# Altium schematic sheet lms_interface.SchDoc
size 381 x 241 mm; SheetNumber: 14; SheetTotal: 17
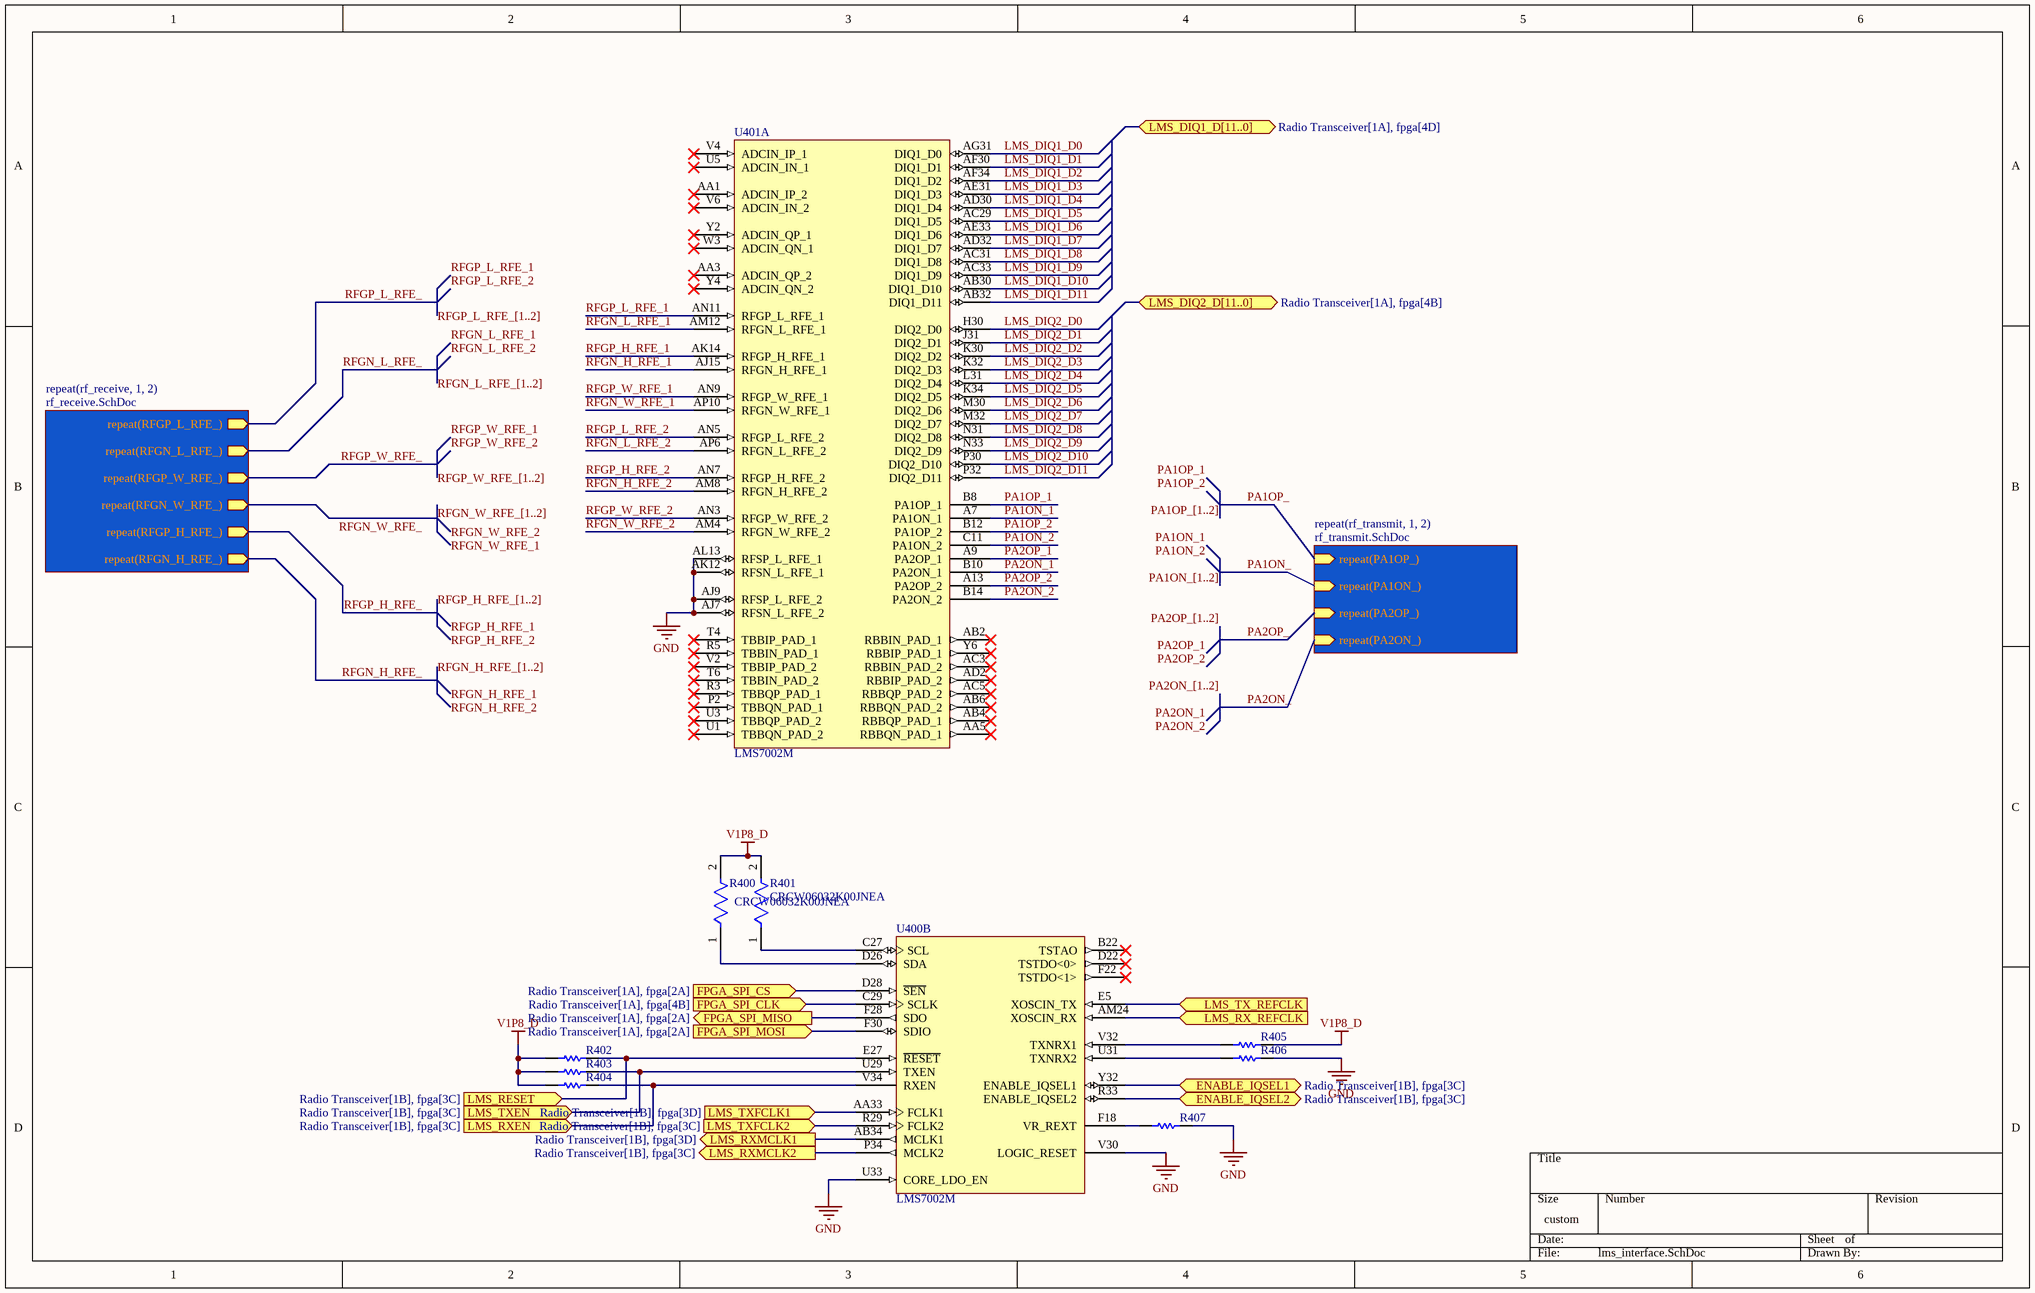
[diagram p0: lms_interface.SchDoc]

## Parts
R400  CRCW06032K00JNEA  [FP-CRCW0603-e3-MFG]
R401  CRCW06032K00JNEA  [FP-CRCW0603-e3-MFG]
R402  ERJ-2GEJ103X  [RESC1005X40X25ML05T05]  (value not drawn)
R403  ERJ-2GEJ103X  [RESC1005X40X25ML05T05]  (value not drawn)
R404  ERJ-2GEJ103X  [RESC1005X40X25ML05T05]  (value not drawn)
R405  ERJ-2GEJ103X  [RESC1005X40X25ML05T05]  (value not drawn)
R406  ERJ-2GEJ103X  [RESC1005X40X25ML05T05]  (value not drawn)
R407  ERJ-2GEJ103X  [RESC1005X40X25ML05T05]  (value not drawn)
U400  LMS7002M  [LM-QFN-261_V]  (part B of 4)
U401  LMS7002M  [LM-QFN-261_V]  (part A of 4)

## Sub-sheets
repeat(rf_receive, 1, 2) = rf_receive.SchDoc: repeat(RFGP_L_RFE_) (out), repeat(RFGP_W_RFE_) (out), repeat(RFGP_H_RFE_) (out), repeat(RFGN_L_RFE_) (out), repeat(RFGN_H_RFE_) (out), repeat(RFGN_W_RFE_) (out)
repeat(rf_transmit, 1, 2) = rf_transmit.SchDoc: repeat(PA1OP_), repeat(PA1ON_), repeat(PA2OP_), repeat(PA2ON_)

## Ports
ENABLE_IQSEL1 (bidir, see Radio Transceiver[1B], fpga[3C]), ENABLE_IQSEL2 (bidir, see Radio Transceiver[1B], fpga[3C]), FPGA_SPI_CLK (in, see Radio Transceiver[1A], fpga[4B]), FPGA_SPI_CS (in, see Radio Transceiver[1A], fpga[2A]), FPGA_SPI_MISO (out, see Radio Transceiver[1A], fpga[2A]), FPGA_SPI_MOSI (in, see Radio Transceiver[1A], fpga[2A]), LMS_DIQ1_D[11..0] (bidir, see Radio Transceiver[1A], fpga[4D]), LMS_DIQ2_D[11..0] (bidir, see Radio Transceiver[1A], fpga[4B]), LMS_RESET (in, see Radio Transceiver[1B], fpga[3C]), LMS_RX_REFCLK (in), LMS_RXEN (in, see Radio Transceiver[1B], fpga[3C]), LMS_RXMCLK1 (out, see Radio Transceiver[1B], fpga[3D]), LMS_RXMCLK2 (out, see Radio Transceiver[1B], fpga[3C]), LMS_TX_REFCLK (in), LMS_TXEN (in, see Radio Transceiver[1B], fpga[3C]), LMS_TXFCLK1 (in, see Radio Transceiver[1B], fpga[3D]), LMS_TXFCLK2 (in, see Radio Transceiver[1B], fpga[3C])

## Nets
GND: R406.2 R407.2 U400.U33(CORE_LDO_EN) U400.V30(LOGIC_RESET) U401.AJ7(RFSN_L_RFE_2) U401.AJ9(RFSP_L_RFE_2) U401.AK12(RFSN_L_RFE_1) U401.AL13(RFSP_L_RFE_1)
V1P8_D: R400.2 R401.2 R402.1 R403.1 R404.1 R405.2
ENABLE_IQSEL1: U400.Y32(ENABLE_IQSEL1) ; port ENABLE_IQSEL1
ENABLE_IQSEL2: U400.R33(ENABLE_IQSEL2) ; port ENABLE_IQSEL2
FPGA_SPI_CLK: U400.C29(SCLK) ; port FPGA_SPI_CLK
FPGA_SPI_CS: U400.D28(~{SEN}) ; port FPGA_SPI_CS
FPGA_SPI_MISO: U400.F28(SDO) ; port FPGA_SPI_MISO
FPGA_SPI_MOSI: U400.F30(SDIO) ; port FPGA_SPI_MOSI
LMS_DIQ1_D0: U401.AG31(DIQ1_D0)
LMS_DIQ1_D1: U401.AF30(DIQ1_D1)
LMS_DIQ1_D2: U401.AF34(DIQ1_D2)
LMS_DIQ1_D3: U401.AE31(DIQ1_D3)
LMS_DIQ1_D4: U401.AD30(DIQ1_D4)
LMS_DIQ1_D5: U401.AC29(DIQ1_D5)
LMS_DIQ1_D6: U401.AE33(DIQ1_D6)
LMS_DIQ1_D7: U401.AD32(DIQ1_D7)
LMS_DIQ1_D8: U401.AC31(DIQ1_D8)
LMS_DIQ1_D9: U401.AC33(DIQ1_D9)
LMS_DIQ1_D10: U401.AB30(DIQ1_D10)
LMS_DIQ1_D11: U401.AB32(DIQ1_D11)
LMS_DIQ2_D0: U401.H30(DIQ2_D0)
LMS_DIQ2_D1: U401.J31(DIQ2_D1)
LMS_DIQ2_D2: U401.K30(DIQ2_D2)
LMS_DIQ2_D3: U401.K32(DIQ2_D3)
LMS_DIQ2_D4: U401.L31(DIQ2_D4)
LMS_DIQ2_D5: U401.K34(DIQ2_D5)
LMS_DIQ2_D6: U401.M30(DIQ2_D6)
LMS_DIQ2_D7: U401.M32(DIQ2_D7)
LMS_DIQ2_D8: U401.N31(DIQ2_D8)
LMS_DIQ2_D9: U401.N33(DIQ2_D9)
LMS_DIQ2_D10: U401.P30(DIQ2_D10)
LMS_DIQ2_D11: U401.P32(DIQ2_D11)
LMS_RESET: R402.2 U400.E27(~{RESET}) ; port LMS_RESET
LMS_RX_REFCLK: U400.AM24(XOSCIN_RX) ; port LMS_RX_REFCLK
LMS_RXEN: R404.2 U400.V34(RXEN) ; port LMS_RXEN
LMS_RXMCLK1: U400.AB34(MCLK1) ; port LMS_RXMCLK1
LMS_RXMCLK2: U400.P34(MCLK2) ; port LMS_RXMCLK2
LMS_TX_REFCLK: U400.E5(XOSCIN_TX) ; port LMS_TX_REFCLK
LMS_TXEN: R403.2 U400.U29(TXEN) ; port LMS_TXEN
LMS_TXFCLK1: U400.AA33(FCLK1) ; port LMS_TXFCLK1
LMS_TXFCLK2: U400.R29(FCLK2) ; port LMS_TXFCLK2
PA1ON_: sheet repeat(rf_transmit, 1, 2)/repeat(PA1ON_)
PA1ON_1: U401.A7(PA1ON_1)
PA1ON_2: U401.C11(PA1ON_2)
PA1OP_: sheet repeat(rf_transmit, 1, 2)/repeat(PA1OP_)
PA1OP_1: U401.B8(PA1OP_1)
PA1OP_2: U401.B12(PA1OP_2)
PA2ON_: sheet repeat(rf_transmit, 1, 2)/repeat(PA2ON_)
PA2ON_1: U401.B10(PA2ON_1)
PA2ON_2: U401.B14(PA2ON_2)
PA2OP_: sheet repeat(rf_transmit, 1, 2)/repeat(PA2OP_)
PA2OP_1: U401.A9(PA2OP_1)
PA2OP_2: U401.A13(PA2OP_2)
RFGN_H_RFE_: sheet repeat(rf_receive, 1, 2)/repeat(RFGN_H_RFE_)
RFGN_H_RFE_1: U401.AJ15(RFGN_H_RFE_1)
RFGN_H_RFE_2: U401.AM8(RFGN_H_RFE_2)
RFGN_L_RFE_: sheet repeat(rf_receive, 1, 2)/repeat(RFGN_L_RFE_)
RFGN_L_RFE_1: U401.AM12(RFGN_L_RFE_1)
RFGN_L_RFE_2: U401.AP6(RFGN_L_RFE_2)
RFGN_W_RFE_: sheet repeat(rf_receive, 1, 2)/repeat(RFGN_W_RFE_)
RFGN_W_RFE_1: U401.AP10(RFGN_W_RFE_1)
RFGN_W_RFE_2: U401.AM4(RFGN_W_RFE_2)
RFGP_H_RFE_: sheet repeat(rf_receive, 1, 2)/repeat(RFGP_H_RFE_)
RFGP_H_RFE_1: U401.AK14(RFGP_H_RFE_1)
RFGP_H_RFE_2: U401.AN7(RFGP_H_RFE_2)
RFGP_L_RFE_: sheet repeat(rf_receive, 1, 2)/repeat(RFGP_L_RFE_)
RFGP_L_RFE_1: U401.AN11(RFGP_L_RFE_1)
RFGP_L_RFE_2: U401.AN5(RFGP_L_RFE_2)
RFGP_W_RFE_: sheet repeat(rf_receive, 1, 2)/repeat(RFGP_W_RFE_)
RFGP_W_RFE_1: U401.AN9(RFGP_W_RFE_1)
RFGP_W_RFE_2: U401.AN3(RFGP_W_RFE_2)
NetR400_1: R400.1 U400.D26(SDA)
NetR401_1: R401.1 U400.C27(SCL)
NetR405_1: R405.1 U400.V32(TXNRX1)
NetR406_1: R406.1 U400.U31(TXNRX2)
NetR407_1: R407.1 U400.F18(VR_REXT)

Not connected (* = marked no-connect by the designer): U400 B22(TSTAO)* D22(TSTDO<0>)* F22(TSTDO<1>)*; U401 AA1(ADCIN_IP_2)* AA3(ADCIN_QP_2)* AA5(RBBQN_PAD_1)* AB2(RBBIN_PAD_1)* AB4(RBBQP_PAD_1)* AB6(RBBQN_PAD_2)* AC3(RBBIN_PAD_2)* AC5(RBBQP_PAD_2)* AD2(RBBIP_PAD_2)* P2(TBBQN_PAD_1)* R3(TBBQP_PAD_1)* R5(TBBIN_PAD_1)* T4(TBBIP_PAD_1)* T6(TBBIN_PAD_2)* U1(TBBQN_PAD_2)* U3(TBBQP_PAD_2)* U5(ADCIN_IN_1)* V2(TBBIP_PAD_2)* V4(ADCIN_IP_1)* V6(ADCIN_IN_2)* W3(ADCIN_QN_1)* Y2(ADCIN_QP_1)* Y4(ADCIN_QN_2)* Y6(RBBIP_PAD_1)*

## Buses and harness runs
bus PA1ON_[1..2]
bus PA1OP_[1..2]
bus PA2ON_[1..2]
bus PA2OP_[1..2]
bus RFGN_H_RFE_[1..2]
bus RFGN_L_RFE_[1..2]
bus RFGN_W_RFE_[1..2]
bus RFGP_H_RFE_[1..2]
bus RFGP_L_RFE_[1..2]
bus RFGP_W_RFE_[1..2]

## Notes on the sheet
- Labels drawn without touching a wire or pin: PA1ON_1, PA1ON_2, PA1OP_1, PA1OP_2, PA2ON_1, PA2ON_2, PA2OP_1, PA2OP_2, RFGN_H_RFE_1, RFGN_H_RFE_2, RFGN_L_RFE_1, RFGN_L_RFE_2, RFGN_W_RFE_1, RFGN_W_RFE_2, RFGP_H_RFE_1, RFGP_H_RFE_2, RFGP_L_RFE_1, RFGP_L_RFE_2, RFGP_W_RFE_1, RFGP_W_RFE_2

## Library data of the parts
R400 R401 = CMP-2000-03163-2: RES Thick Film, 2kΩ, 5%, 0.1W, 200ppm/°C, 0603; Power Rating: 100mW; Working Voltage: 75V; Resistance: 2kR; Min Operating Temperature: -55°C; Package Quantity: 1; Contact Plating: Tin; Number of Terminations: 2; Depth: 0.85mm; Radiation Hardening: No; Weight: 7.1E-05oz; Case Code (Imperial): 0603; Tolerance: 5%; Length: 1.55mm; Temperature Coefficient: 200ppm/°C; Width: 0.033inch; Mount: Surface Mount; Case Code (Metric): 1608; Voltage Rating: 75V; Height: 0.45mm; Case/Package: 0603; Military Standard: Not; Features: Automotive AEC-Q200; Number of Pins: 2; Lead Free: Lead Free; Composition: Thick Film; Packaging: Tape and Reel; Max Operating Temperature: 155°C; Voltage Rating (DC): 75V; Max Power Dissipation: 100mW; Termination: SMD/SMT
R402-R407 = CMP-2002-00433-1: Manufacturer: Panasonic; Part Number: ERJ-2GEJ103X
U400 U401 = CMP-2000-06561-1: FPRF MIMO Transceiver IC with Integrated Microcontroller, 1.1 to 1.89 V, -40 to 85 degC, 261-Pin QFN, RoHS; Manufacturer: LimeMicrosystemsLtd; Current - Receiving: 420mA; Protocol: CDMA,GSM,HSPA,LTE,TD-SCDMA,WCDMA; Frequency: 100kHz~3.8GHz; Current - Transmitting: 350mA; Memory Size: 10kBSRAM; Power - Output: 0dBm; Serial Interfaces: SPI; RF Family/Standard: Cellular; Voltage - Supply: 1.1V~1.89V; GPIO: -; Data Rate (Max): -; Family: RFTransceiverICs; Modulation: -; Mounting Technology: SurfaceMount; Datasheet URL: http://www.richardsonrfpd.com/resources/RellDocuments/SYS_31/LMS7002M.pdf; Package Description: 261-Pin Quad Flat No-lead Package, Body 11.5 x 11.5 mm, Pitch 0.666 mm; Series: -; Sensitivity: -; Category: RF/IFandRFID; Package Reference: QFN-261; Package / Case: 261-SMDModule; Package URL: http://cdn.limemicro.com/wp-content/uploads/2015/08/LMS7002M-PCB-Layout-Recommendations-1.0r5.pdf; Operating Temperature: -40°C~85°C; Manufacturer URL: http://www.limemicro.com/; Packaging: Tray; Datasheet Version: Rev. 2.8.0, 09/2015; Type: TxRx+MCU